# EAGLE design Receiver (EAGLE 7.3.0)
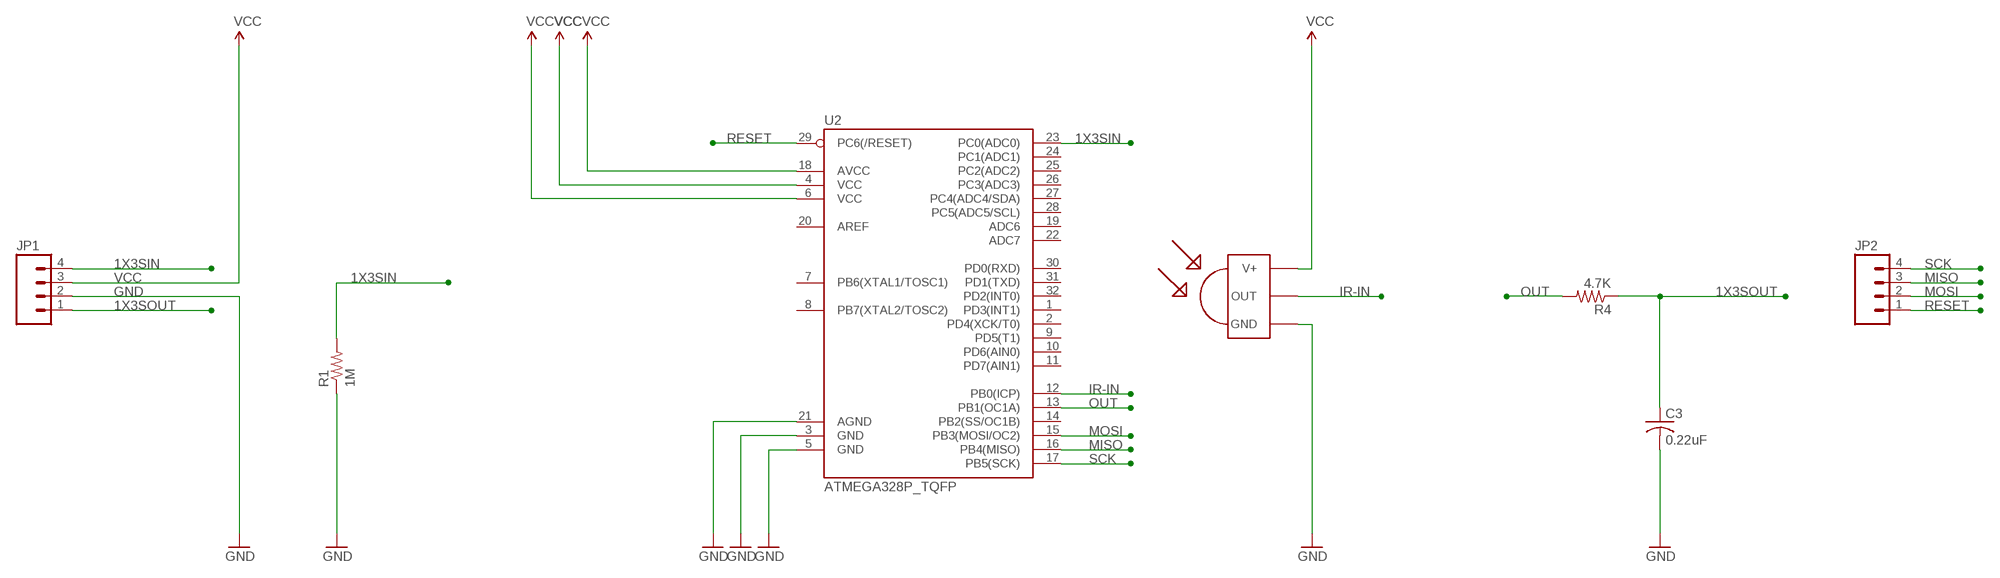
[diagram p0: schematic, sheet 1]

## Parts
C3  0.22uF  C-USC0603  [C0603]
JP1  M04PTH  [1X04]
JP2  M04PTH  [1X04]
R1  1M  R-US_R0603  [R0603]
R4  4.7K  R-US_R0603  [R0603]
U2  ATMEGA328P_TQFP  [TQFP32-08]
U$1  IR-RECEIVER  [TSOP382XX,384XX]

## Nets
1X3SIN: JP1.4 R1.2 U2.23(PC0(ADC0))
1X3SOUT: C3.1 JP1.1 R4.1
GND: C3.2 JP1.2 R1.1 U2.3(GND) U2.5(GND) U2.21(AGND) U$1.GND
IR-IN: U2.12(PB0(ICP)) U$1.OUT
MISO: JP2.3 U2.16(PB4(MISO))
MOSI: JP2.2 U2.15(PB3(MOSI/OC2))
OUT: R4.2 U2.13(PB1(OC1A))
RESET: JP2.1 U2.29(PC6(/RESET))
SCK: JP2.4 U2.17(PB5(SCK))
VCC: JP1.3 U2.4(VCC) U2.6(VCC) U2.18(AVCC) U$1.VSS(V+)
Unconnected: U2.1(PD3(INT1)) U2.2(PD4(XCK/T0)) U2.7(PB6(XTAL1/TOSC1)) U2.8(PB7(XTAL2/TOSC2)) U2.9(PD5(T1)) U2.10(PD6(AIN0)) U2.11(PD7(AIN1)) U2.14(PB2(SS/OC1B)) U2.19(ADC6) U2.20(AREF) U2.22(ADC7) U2.24(PC1(ADC1)) U2.25(PC2(ADC2)) U2.26(PC3(ADC3)) U2.27(PC4(ADC4/SDA)) U2.28(PC5(ADC5/SCL)) U2.30(PD0(RXD)) U2.31(PD1(TXD)) U2.32(PD2(INT0))

## Library data of the parts
C3 = adafruit:C-US: CAPACITOR, American symbol
JP1 JP2 = SparkFun-Connectors:M04: Header 4 Standard 4-pin 0.1" header. Use with straight break away headers (SKU : PRT-00116), right angle break away headers (PRT-00553), swiss pins (PRT-00743), machine pins (PRT-00117), and female headers (PRT-00115). Molex polarized connector foot print use with SKU : PRT-08231 with associated crimp pins and housings. 1MM SMD Version SKU: PRT-10208
R1 R4 = adafruit:R-US_: RESISTOR, American symbol
U2 = SparkFun-DigitalIC:ATMEGA328P_TQFP; PROD_ID: IC-09069
U$1 = MakerWear:IR-RECEIVER

## Board
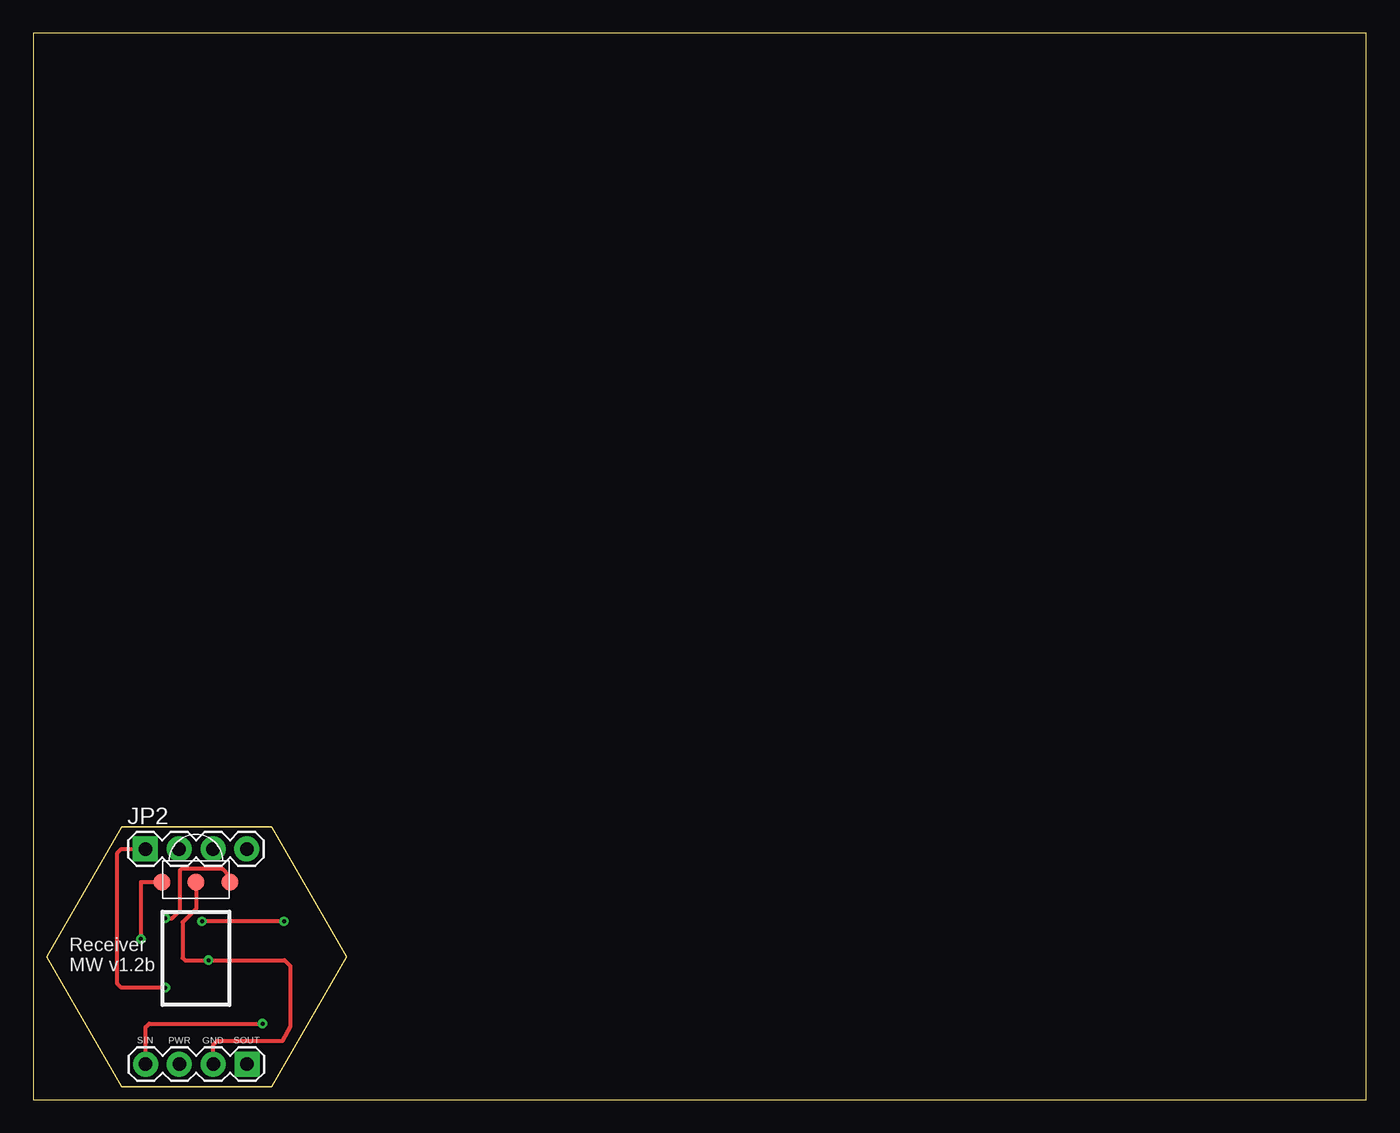
[diagram p1: board, top side]
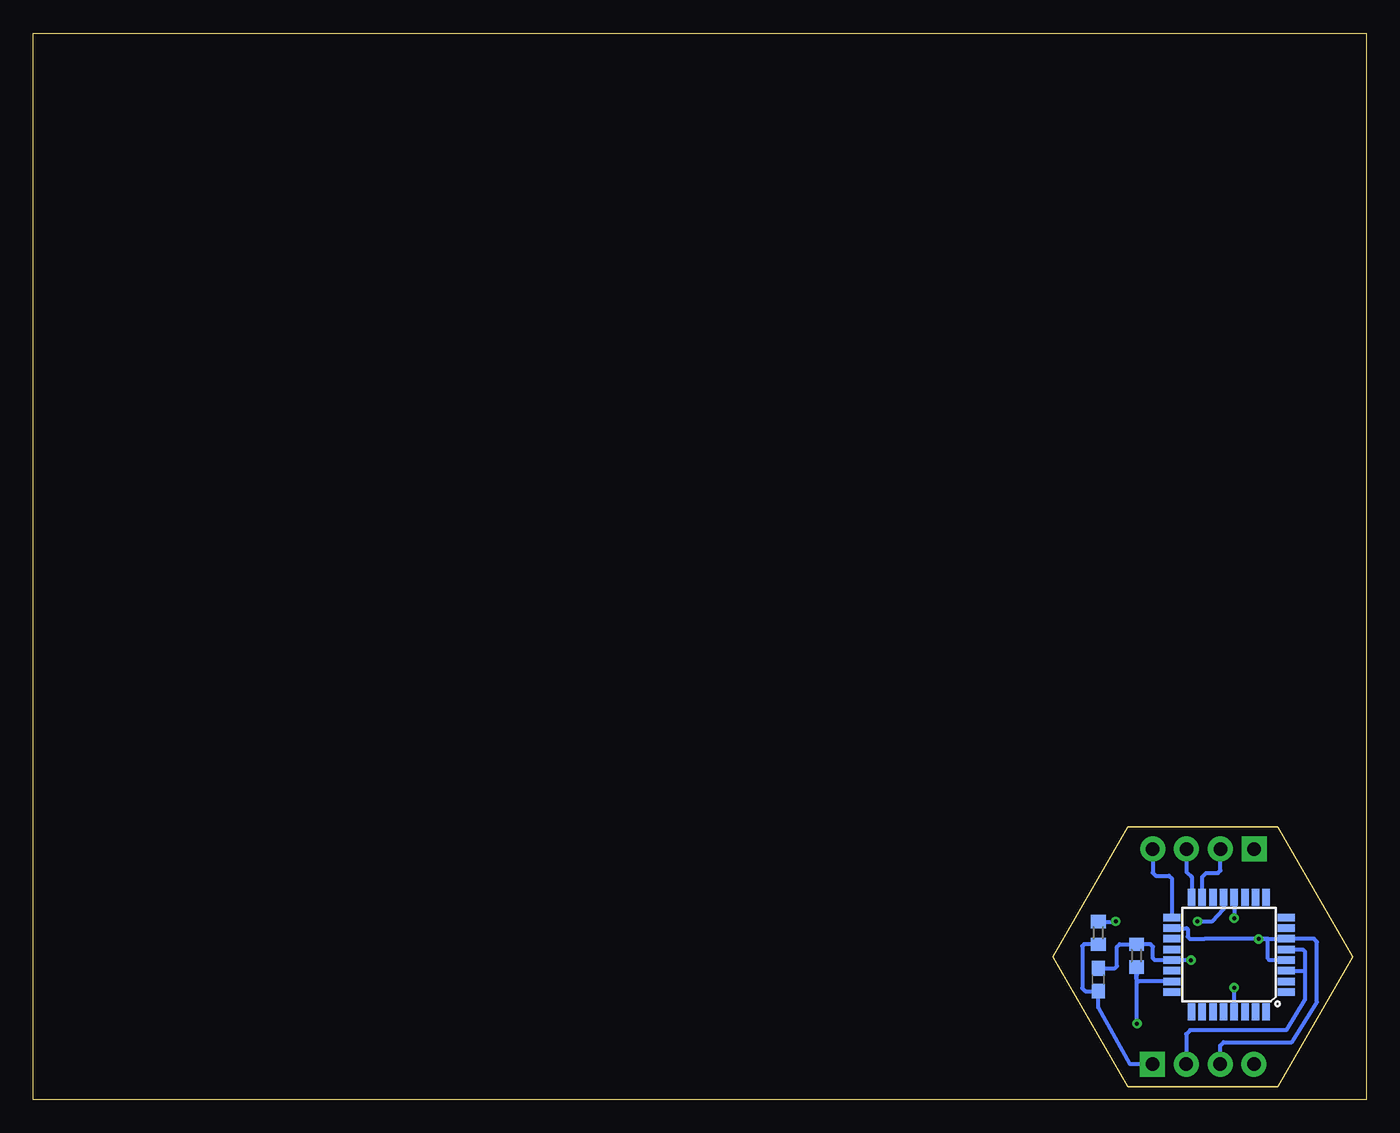
[diagram p2: board, bottom side, seen from below]

Size 100 x 80 mm. Coordinates in mm from the lower left corner, seen from the top.
Outline: 0,0 100,0 100,80 0,80 0,0
Outline: 23.49,10.7 17.86,0.96 6.61,0.96 0.99,10.7 6.61,20.44 17.86,20.44 23.49,10.7
Copper layers (1*16): Top 0.035mm / dielectric 1.5mm / Bottom 0.035mm
Design rules "default *": minimum track width 10mil, minimum drill 24mil, track to track 8mil, track to pad 8mil, pad to pad 8mil, via to via 8mil, smd to smd 8mil, copper to edge 0mil, drill to drill 8mil, minimum pad ring 10mil, minimum via ring 8mil, stop-mask expansion 4mil, vias tented up to drill 0mil, thermal gap 10mil

### Footprints (pad centres in the part's own frame; a part is rotated, then mirrored left to right if it is on the bottom)
C0603 = smd 1.1 x 1: 1 -0.85,0; 2 0.85,0
1X04 = drill 1.016 pad 1.88 square: 1 0,0 | drill 1.016 pad 1.88: 2 2.54,0; 3 5.08,0; 4 7.62,0
R0603 = smd 1 x 1.1: 1 -0.85,0; 2 0.85,0
TQFP32-08 = smd 1.27 x 0.559: 1 -4.293,2.8; 2 -4.293,2; 3 -4.293,1.2; 4 -4.293,0.4; 5 -4.293,-0.4; 6 -4.293,-1.2; 7 -4.293,-2; 8 -4.293,-2.8; 17 4.293,-2.8; 18 4.293,-2; 19 4.293,-1.2; 20 4.293,-0.4; 21 4.293,0.4; 22 4.293,1.2; 23 4.293,2; 24 4.293,2.8 | smd 0.559 x 1.27: 9 -2.8,-4.293; 10 -2,-4.293; 11 -1.2,-4.293; 12 -0.4,-4.293; 13 0.4,-4.293; 14 1.2,-4.293; 15 2,-4.293; 16 2.8,-4.293; 25 2.8,4.293; 26 2,4.293; 27 1.2,4.293; 28 0.4,4.293; 29 -0.4,4.293; 30 -1.2,4.293; 31 -2,4.293; 32 -2.8,4.293
TSOP382XX,384XX = smd 1.27 x 1.27: GND 0,1.6; OUT -2.54,1.6; VSS 2.54,1.6

### Placement (x,y rotation side)
C3  20.1,9 90 bottom
JP1  16.04,2.66 180 top
JP2  8.4,18.8 0 top
R1  17.23,10.8 270 bottom
R4  20.1,12.5 90 bottom
U2  10.3,10.86 180 bottom
U$1  12.2,17.9 180 top

### Tracks (layer width: path | path; a pad name or v marks a point on that pad's centre or on a via)
1X3SIN  (via drill 0.3 pad 0.25)
  Top 0.305: JP1.4 8.42,5.42 8.7,5.7 v17.2,5.7
  Bottom 0.305: U2.23 17.07,8.86 17.23,9.02 17.23,9.4 | 17.23,9.4 R1.2 | v17.2,5.7 17.2,9.37 17.23,9.4
1X3SOUT
  Bottom 0.305: R4.1 21.15,11.65 21.3,11.5 21.3,8.35 21.08,8.13 20.12,8.13 C3.1 20.1,6.9 17.72,2.66 JP1.1
GND  (via drill 0.3 pad 0.25)
  Top 0.305: U$1.GND 12.2,14.3 11.2,13.3 11.2,10.62 11.37,10.45 v13.14,10.45 18.85,10.45 19.3,10 19.3,5.5 18.7,4.4 13.8,4.4 13.5,4.1 JP1.2
  Bottom 0.305: C3.2 18.85,9.85 18.7,10 18.7,11.46 18.5,11.66 R1.1 16.18,11.65 16,11.47 16,10.6 15.86,10.46 U2.21 v13.14,10.45 | U2.5 4.76,11.26 4.6,11.1 4.6,9.6 | 4.6,9.6 4.6,7.5 6,5.2 13.2,5.2 13.5,4.9 JP1.2 | U2.3 4.66,9.66 4.6,9.6
IR-IN  (via drill 0.3 pad 0.25)
  Top 0.305: U$1.OUT 14.74,16.76 14.2,17.3 11.1,17.3 11,17.2 11,14.2 10.4,13.6 v9.9,13.6
  Bottom 0.305: U2.12 v9.9,13.6
MISO
  Bottom 0.305: JP2.3 13.48,17.08 13.1,16.7 U2.16
MOSI
  Bottom 0.305: U2.15 12.3,16.7 12,17 11.12,17 10.93,17.19 JP2.2
OUT  (via drill 0.3 pad 0.25)
  Top 0.305: v18.8,13.37 v12.66,13.37
  Bottom 0.305: R4.2 18.82,13.35 v18.8,13.37 | v12.66,13.37 11.53,13.37 10.7,14.3 U2.13
RESET  (via drill 0.3 pad 0.25)
  Top 0.305: v9.9,8.4 6.6,8.4 6.3,8.7 6.3,18.5 6.6,18.8 JP2.1
  Bottom 0.305: U2.29 v9.9,8.4
SCK
  Bottom 0.305: JP2.4 16.02,17.02 15.8,16.8 14.8,16.8 14.6,16.6 U2.17
VCC  (via drill 0.3 pad 0.25)
  Top 0.305: U$1.VSS 8.06,16.3 v8.06,12.05
  Bottom 0.305: U2.4 7.26,10.46 7.4,10.6 7.4,12.05 7.39,12.06 | 7.39,12.06 U2.6 3.93,12.06 3.7,11.83 3.7,7.3 5.6,4.3 10.7,4.3 10.96,4.04 JP1.3 | 12.08,12.06 12.09,12.07 | U2.18 13.46,12.86 13.4,12.8 13.4,12.21 13.26,12.07 12.09,12.07 | v8.06,12.05 7.39,12.05 7.39,12.06 | 7.39,12.06 12.09,12.06 12.09,12.07

### Text on the board
tPlace: Receiver / MW v1.2b | SIN | PWR | GND | SOUT